# EAGLE design isp renew (EAGLE 6.1)
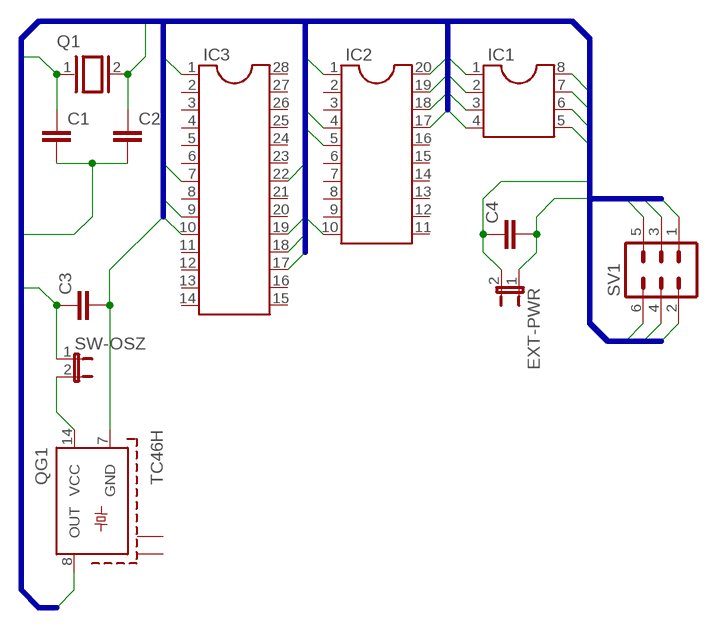
[diagram p0: schematic, sheet 1]

## Parts
C1  C-EU025-025X050  [C025-025X050]
C2  C-EU025-025X050  [C025-025X050]
C3  C-EU025-024X044  [C025-024X044]
C4  C-EU025-025X050  [C025-025X050]
EXT-PWR  JP1E  [JP1]
IC1  DIL8  [DIL08]
IC2  DIL20  [DIL20]
IC3  DIL28-3  [DIL28-3]
Q1  XTAL/S  [QS]
QG1  TC46H  [TC46]
SV1  ML6  [ML6]
SW-OSZ  JP1E  [JP1]

## Nets
GND: C1.2 C2.2 C3.2 C4.2 EXT-PWR.1 IC1.4 IC2.10 IC3.22 QG1.7(GND) SV1.6
MISO: IC1.6 IC2.18 IC3.18 SV1.1
MOSI: IC1.5 IC2.17 IC3.17 SV1.4
N$1: QG1.14(VCC) SW-OSZ.2
RESET: IC1.1 IC2.1 IC3.1 SV1.5
SCK: IC1.7 IC2.19 IC3.19 SV1.3
VCC: C3.1 C4.1 EXT-PWR.2 IC1.8 IC2.20 IC3.7 SV1.2 SW-OSZ.1
XTAL1: C1.1 IC1.2 IC2.4 IC3.9 Q1.1 QG1.8(OUT)
XTAL2: C2.1 IC1.3 IC2.5 IC3.10 Q1.2
Unconnected: IC2.2 IC2.3 IC2.6 IC2.7 IC2.8 IC2.9 IC2.11 IC2.12 IC2.13 IC2.14 IC2.15 IC2.16 IC3.2 IC3.3 IC3.4 IC3.5 IC3.6 IC3.8 IC3.11 IC3.12 IC3.13 IC3.14 IC3.15 IC3.16 IC3.20 IC3.21 IC3.23 IC3.24 IC3.25 IC3.26 IC3.27 IC3.28 QG1.S@1(S1) QG1.S@2(S2)

## Buses
LINE:MOSI,MISO,RESET,SCK,VCC,GND,XTAL1,XTAL2

## Library data of the parts
C1-C4 = rcl:C-EU: CAPACITOR, European symbol
EXT-PWR SW-OSZ = jumper:JP1E: JUMPER
IC1 = ic-package:DIL8: Dual In Line / Socket
IC2 = ic-package:DIL20: Dual In Line / Socket
IC3 = ic-package:DIL28: Dual In Line
Q1 = special:XTAL/S: CRYSTAL
QG1 = crystal:TC46: Temperature Compensated Xtal Oscillator HCMOS, Clipped Sine Wave or Sine Wave Compatible Source: www.pletronics.com .. tc4.pdf; OC_FARNELL: unknown; OC_NEWARK: unknown
SV1 = con-harting-ml:ML6: HARTING; OC_FARNELL: unknown; OC_NEWARK: unknown

## Board
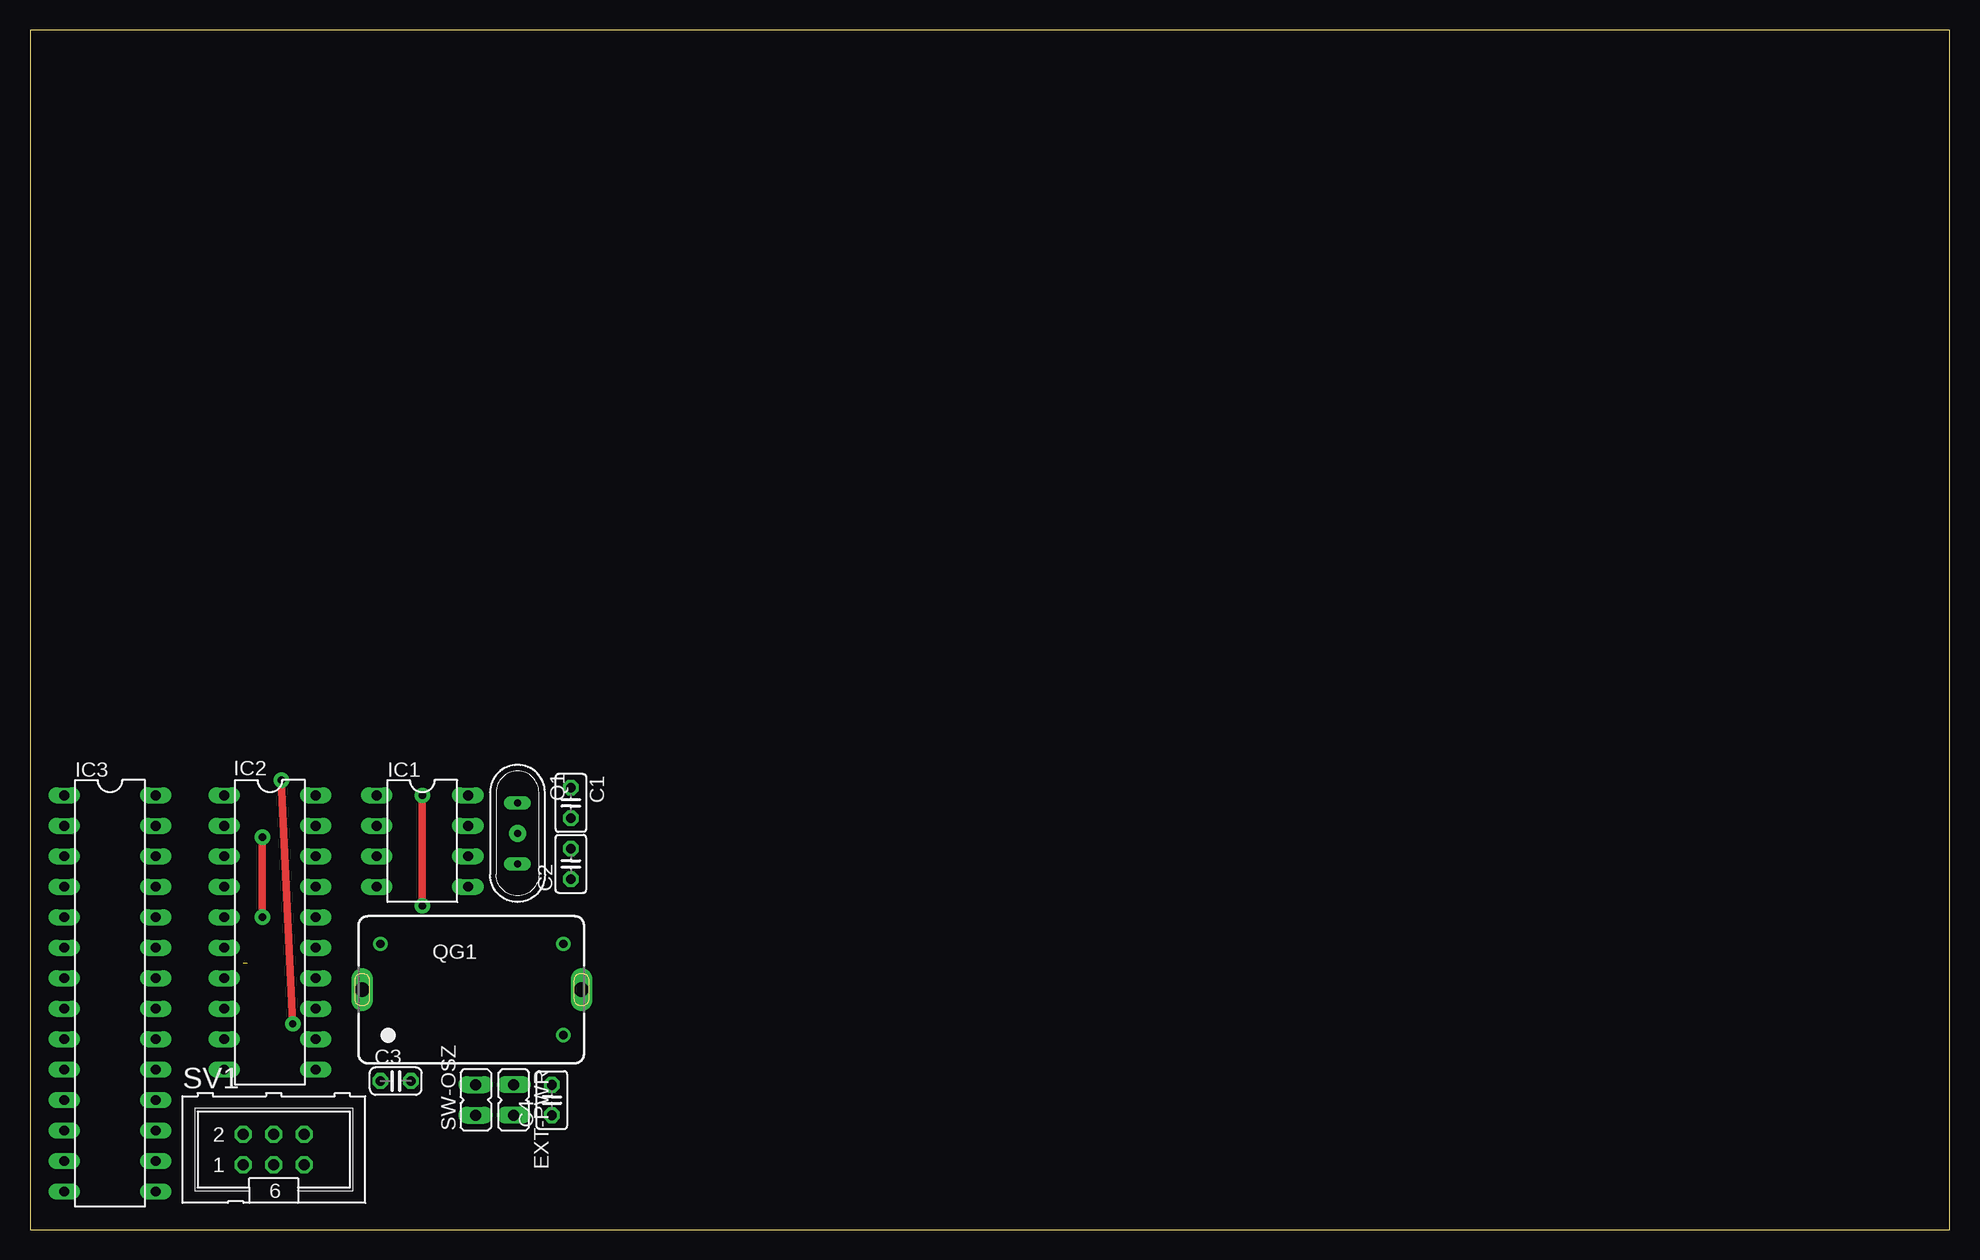
[diagram p1: board, top side]
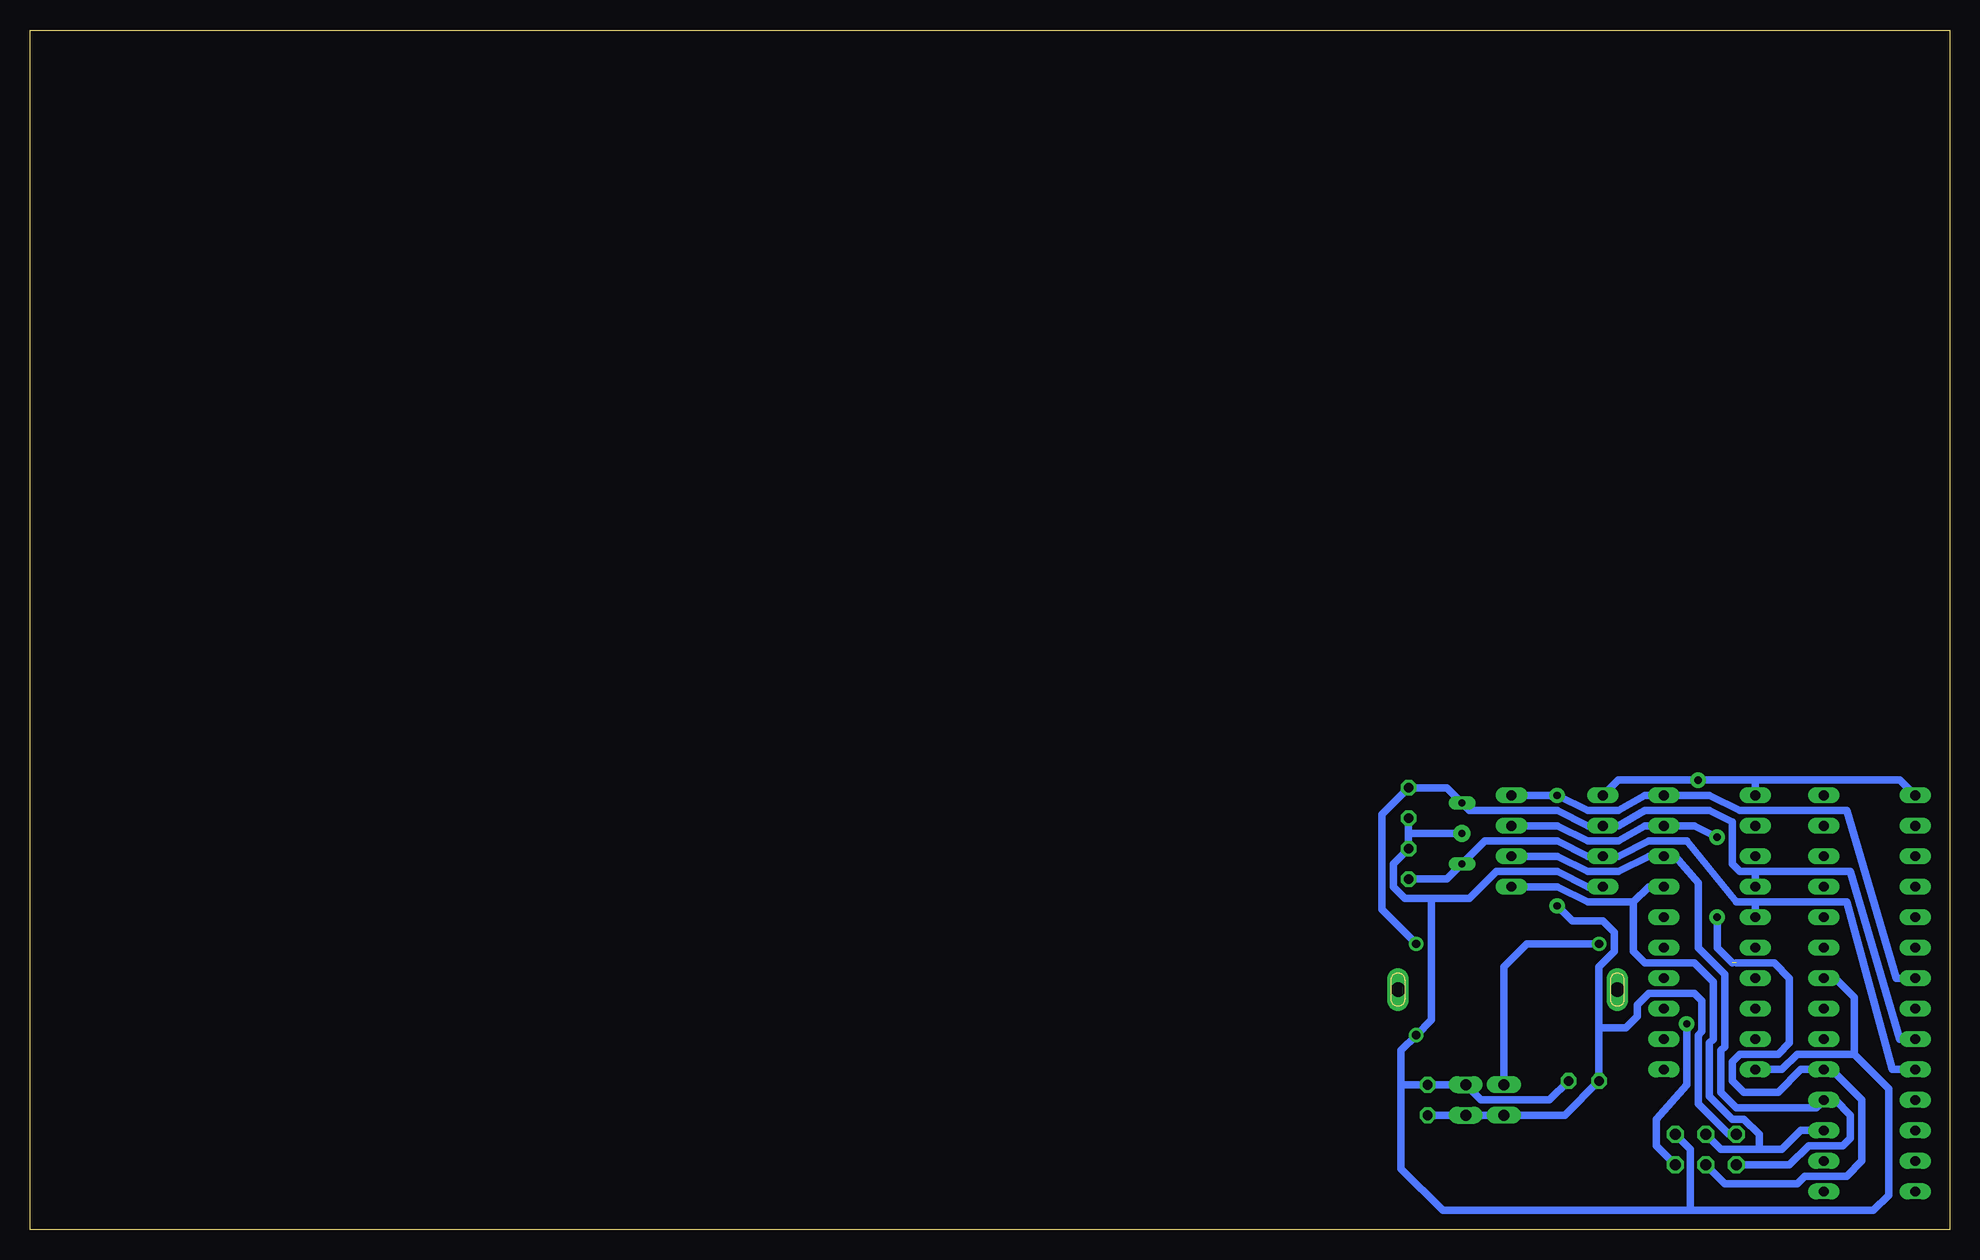
[diagram p2: board, bottom side, seen from below]

Size 160 x 100 mm. Coordinates in mm from the lower left corner, seen from the top.
Outline: 0,0 160,0 160,100 0,100 0,0
Copper layers (1*16): Top 0.035mm / dielectric 1.5mm / Bottom 0.035mm
Design rules: minimum track width 10mil, minimum drill 24mil, track to track 8mil, track to pad 8mil, pad to pad 8mil, via to via 8mil, smd to smd 8mil, copper to edge 40mil, drill to drill 8mil, minimum pad ring 10mil, minimum via ring 8mil, stop-mask expansion 4mil, vias tented up to drill 0mil, thermal gap 10mil

### Footprints (pad centres in the part's own frame; a part is rotated, then mirrored left to right if it is on the bottom)
C025-025X050 = drill 0.813 octagon: 1 -1.27,0; 2 1.27,0
C025-024X044 = drill 0.813 octagon: 1 -1.27,0; 2 1.27,0
JP1 = drill 0.914 long: 1 0,-1.27; 2 0,1.27
DIL08 = drill 0.813 long: 1 -3.81,-3.81; 2 -1.27,-3.81; 3 1.27,-3.81; 4 3.81,-3.81; 5 3.81,3.81; 6 1.27,3.81; 7 -1.27,3.81; 8 -3.81,3.81
DIL20 = drill 0.813 long: 1 -11.43,-3.81; 2 -8.89,-3.81; 3 -6.35,-3.81; 4 -3.81,-3.81; 5 -1.27,-3.81; 6 1.27,-3.81; 7 3.81,-3.81; 8 6.35,-3.81; 9 8.89,-3.81; 10 11.43,-3.81; 11 11.43,3.81; 12 8.89,3.81; 13 6.35,3.81; 14 3.81,3.81; 15 1.27,3.81; 16 -1.27,3.81; 17 -3.81,3.81; 18 -6.35,3.81; 19 -8.89,3.81; 20 -11.43,3.81
DIL28-3 = drill 0.813 long: 1 -16.51,-3.81; 2 -13.97,-3.81; 3 -11.43,-3.81; 4 -8.89,-3.81; 5 -6.35,-3.81; 6 -3.81,-3.81; 7 -1.27,-3.81; 8 1.27,-3.81; 9 3.81,-3.81; 10 6.35,-3.81; 11 8.89,-3.81; 12 11.43,-3.81; 13 13.97,-3.81; 14 16.51,-3.81; 15 16.51,3.81; 16 13.97,3.81; 17 11.43,3.81; 18 8.89,3.81; 19 6.35,3.81; 20 3.81,3.81; 21 1.27,3.81; 22 -1.27,3.81; 23 -3.81,3.81; 24 -6.35,3.81; 25 -8.89,3.81; 26 -11.43,3.81; 27 -13.97,3.81; 28 -16.51,3.81
QS = drill 0.61 long: 1 -2.54,0; 2 2.54,0
TC46 = drill 0.7 pad 1.016: 7 7.62,-3.81; 8 7.62,3.81; 14 -7.62,3.81 | drill 1.2 pad 1.6 long: S@1 -9.144,0 | drill 1.2 pad 1.5 long: S@2 9.144,0
ML6 = drill 0.914 octagon: 1 -2.54,-1.27; 2 -2.54,1.27; 3 0,-1.27; 4 0,1.27; 5 2.54,-1.27; 6 2.54,1.27

### Placement (x,y rotation side)
C1  45.09,35.56 270 top
C2  45.09,30.48 90 top
C3  30.48,12.38 0 top
C4  43.5,10.79 90 top
EXT-PWR  40.32,10.79 180 top
IC1  32.7,32.38 270 top
IC2  20,24.77 270 top
IC3  6.67,19.68 270 top
Q1  40.64,33.02 270 top
QG1  36.83,20 0 top
SV1  20.32,6.67 0 top
SW-OSZ  37.15,10.79 0 top

### Tracks (layer width: path | path; a pad name or v marks a point on that pad's centre or on a via)
GND  (via drill 0.6 pad 1.42)
  Bottom 0.61: 45.09,33.02 C2.2 46.35,30.48 46.35,28.57 45.4,27.62 43.18,27.62 | v40.64,33.02 45.09,33.02 | 45.09,33.02 C1.2 | IC1.4 30.16,28.57 32.7,29.84 37.78,29.84 40.01,27.62 43.18,27.62 | 45.72,12.06 45.72,5.08 42.23,1.59 21.59,1.59 | 45.72,12.06 45.72,14.92 QG1.7 43.18,17.46 43.18,27.62 | C3.2 33.34,10.79 39.05,10.79 EXT-PWR.1 C4.2 45.72,12.06 | IC3.22 9.53,20.95 7.94,19.37 7.94,14.61 | 7.94,14.61 5.08,11.75 5.08,2.86 6.35,1.59 21.59,1.59 | SV1.6 21.59,6.67 21.59,1.59 | IC2.10 13.97,13.34 12.7,14.61 7.94,14.61
MISO
  Bottom 0.61: 37.47,31.11 IC1.6 32.7,31.11 30.16,29.84 27.62,29.84 25.08,31.11 IC2.18 22.86,31.11 20.95,28.89 20.95,23.5 18.73,21.27 18.73,15.24 19.05,14.92 19.05,11.43 17.78,10.16 11.11,10.16 IC3.18 9.53,10.79 8.26,9.53 8.26,7.62 8.89,6.99 11.75,6.99 13.34,5.4 SV1.1
MOSI
  Bottom 0.61: 22.86,28.57 IC2.17 25.08,28.57 26.35,27.3 | IC1.5 32.7,28.57 30.16,27.3 26.35,27.3 | IC3.17 12.38,8.26 13.97,6.67 15.88,6.67 | 15.88,6.67 19.05,6.67 SV1.4 | 26.35,27.3 26.35,23.18 25.4,22.23 21.27,22.23 19.68,20.64 19.68,15.88 20,15.56 20,11.11 18.1,9.21 17.14,9.21 15.88,7.94 15.88,6.67
N$1
  Bottom 0.61: QG1.14 35.24,23.81 37.15,21.91 SW-OSZ.2
RESET  (via drill 0.6 pad 1.27)
  Top 0.61: v21.91,17.14 v20.95,37.47
  Bottom 0.61: IC3.1 4.13,37.47 16.19,37.47 | IC2.1 16.19,37.47 | 16.19,37.47 v20.95,37.47 27.62,37.47 IC1.1 | v21.91,17.14 21.91,12.06 24.45,9.21 24.45,6.99 SV1.5
SCK  (via drill 0.6 pad 1.27)  (1 unrouted)
  Top 0.61: v19.37,32.7 v19.37,26.04
  Bottom 0.61: IC1.7 32.7,33.66 30.16,32.38 27.62,32.38 25.4,33.66 IC2.19 21.27,33.66 v19.37,32.7 | SV1.3 18.73,3.81 12.7,3.81 12.06,4.45 8.57,4.45 7.3,5.71 7.3,10.79 9.84,13.34 IC3.19 12.38,13.34 14.29,11.43 17.14,11.43 18.1,12.38 18.1,13.97 17.46,14.61 14.29,14.61 13.34,15.56 13.34,20.95 14.61,22.23 17.78,22.23 | v19.37,26.04 19.37,23.5 18.1,22.23
VCC  (via drill 0.6 pad 1.27)
  Top 0.61: v32.7,36.2 v32.7,26.99
  Bottom 0.61: IC1.8 v32.7,36.2 30.16,34.92 27.62,34.92 25.4,36.2 IC2.20 20,36.2 17.46,34.92 8.57,34.92 4.45,20.95 IC3.7 | v32.7,26.99 31.43,25.72 28.89,25.72 27.94,24.77 27.94,23.18 29.21,21.91 29.21,16.83 | C4.1 EXT-PWR.2 SW-OSZ.1 32.07,9.53 C3.1 29.21,16.83 | SV1.2 18.41,7.94 20.95,10.48 20.95,16.19 20.64,16.51 20.64,19.05 21.27,19.68 25.08,19.68 26.04,18.73 26.04,17.78 26.99,16.83 29.21,16.83
XTAL1
  Bottom 0.61: IC2.4 16.19,29.84 | 16.19,29.84 17.46,29.84 18.1,30.48 18.1,33.97 20,34.92 25.4,34.92 27.62,33.66 IC1.2 30.16,33.66 32.7,34.92 40.01,34.92 Q1.1 41.91,36.83 C1.1 47.31,34.61 47.31,26.67 QG1.8 | 16.19,29.84 8.26,29.84 4.13,15.88 IC3.9
XTAL2
  Bottom 0.61: IC2.5 16.19,27.3 | 16.19,27.3 17.78,27.3 21.91,32.38 25.08,32.38 27.62,31.11 IC1.3 30.16,31.11 32.7,32.38 38.73,32.38 Q1.2 41.91,29.21 C2.1 | 16.19,27.3 8.57,27.3 4.76,13.34 IC3.10